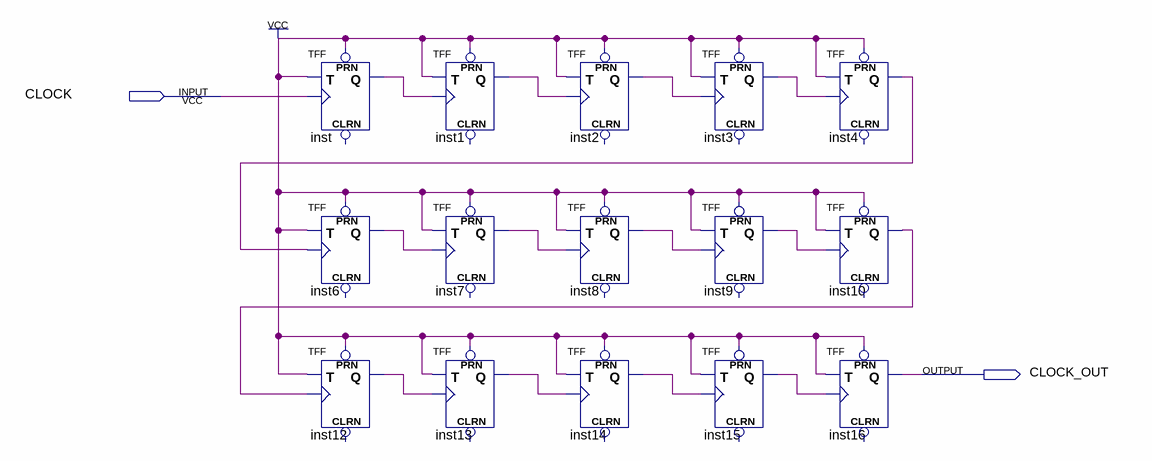
[diagram p0: schematic sheet]
// Quartus schematic div-freq-32m-1k.bdf as structural Verilog: 15 symbols, 2 pins
module \div-freq-32m-1k  (
  input  CLOCK,
  output CLOCK_OUT
);

  wire inst1_q, inst2_q, inst3_q, inst4_q, inst6_q, inst7_q, inst8_q, inst9_q, inst10_q, inst12_q, inst13_q,
       inst14_q, inst15_q, inst_q;

  TFF inst (.PRN(1'b1), .T(1'b1), .CLK(CLOCK), .Q(inst_q));  // open: CLRN
  TFF inst6 (.PRN(1'b1), .T(1'b1), .CLK(inst4_q), .Q(inst6_q));  // open: CLRN
  TFF inst12 (.PRN(1'b1), .T(1'b1), .CLK(inst10_q), .Q(inst12_q));  // open: CLRN
  TFF inst1 (.PRN(1'b1), .T(1'b1), .CLK(inst_q), .Q(inst1_q));  // open: CLRN
  TFF inst7 (.PRN(1'b1), .T(1'b1), .CLK(inst6_q), .Q(inst7_q));  // open: CLRN
  TFF inst13 (.PRN(1'b1), .T(1'b1), .CLK(inst12_q), .Q(inst13_q));  // open: CLRN
  TFF inst2 (.PRN(1'b1), .T(1'b1), .CLK(inst1_q), .Q(inst2_q));  // open: CLRN
  TFF inst8 (.PRN(1'b1), .T(1'b1), .CLK(inst7_q), .Q(inst8_q));  // open: CLRN
  TFF inst14 (.PRN(1'b1), .T(1'b1), .CLK(inst13_q), .Q(inst14_q));  // open: CLRN
  TFF inst3 (.PRN(1'b1), .T(1'b1), .CLK(inst2_q), .Q(inst3_q));  // open: CLRN
  TFF inst9 (.PRN(1'b1), .T(1'b1), .CLK(inst8_q), .Q(inst9_q));  // open: CLRN
  TFF inst15 (.PRN(1'b1), .T(1'b1), .CLK(inst14_q), .Q(inst15_q));  // open: CLRN
  TFF inst4 (.PRN(1'b1), .T(1'b1), .CLK(inst3_q), .Q(inst4_q));  // open: CLRN
  TFF inst10 (.PRN(1'b1), .T(1'b1), .CLK(inst9_q), .Q(inst10_q));  // open: CLRN
  TFF inst16 (.PRN(1'b1), .T(1'b1), .CLK(inst15_q), .Q(CLOCK_OUT));  // open: CLRN
endmodule
